# EAGLE design IDP5 (EAGLE 9.6.2)
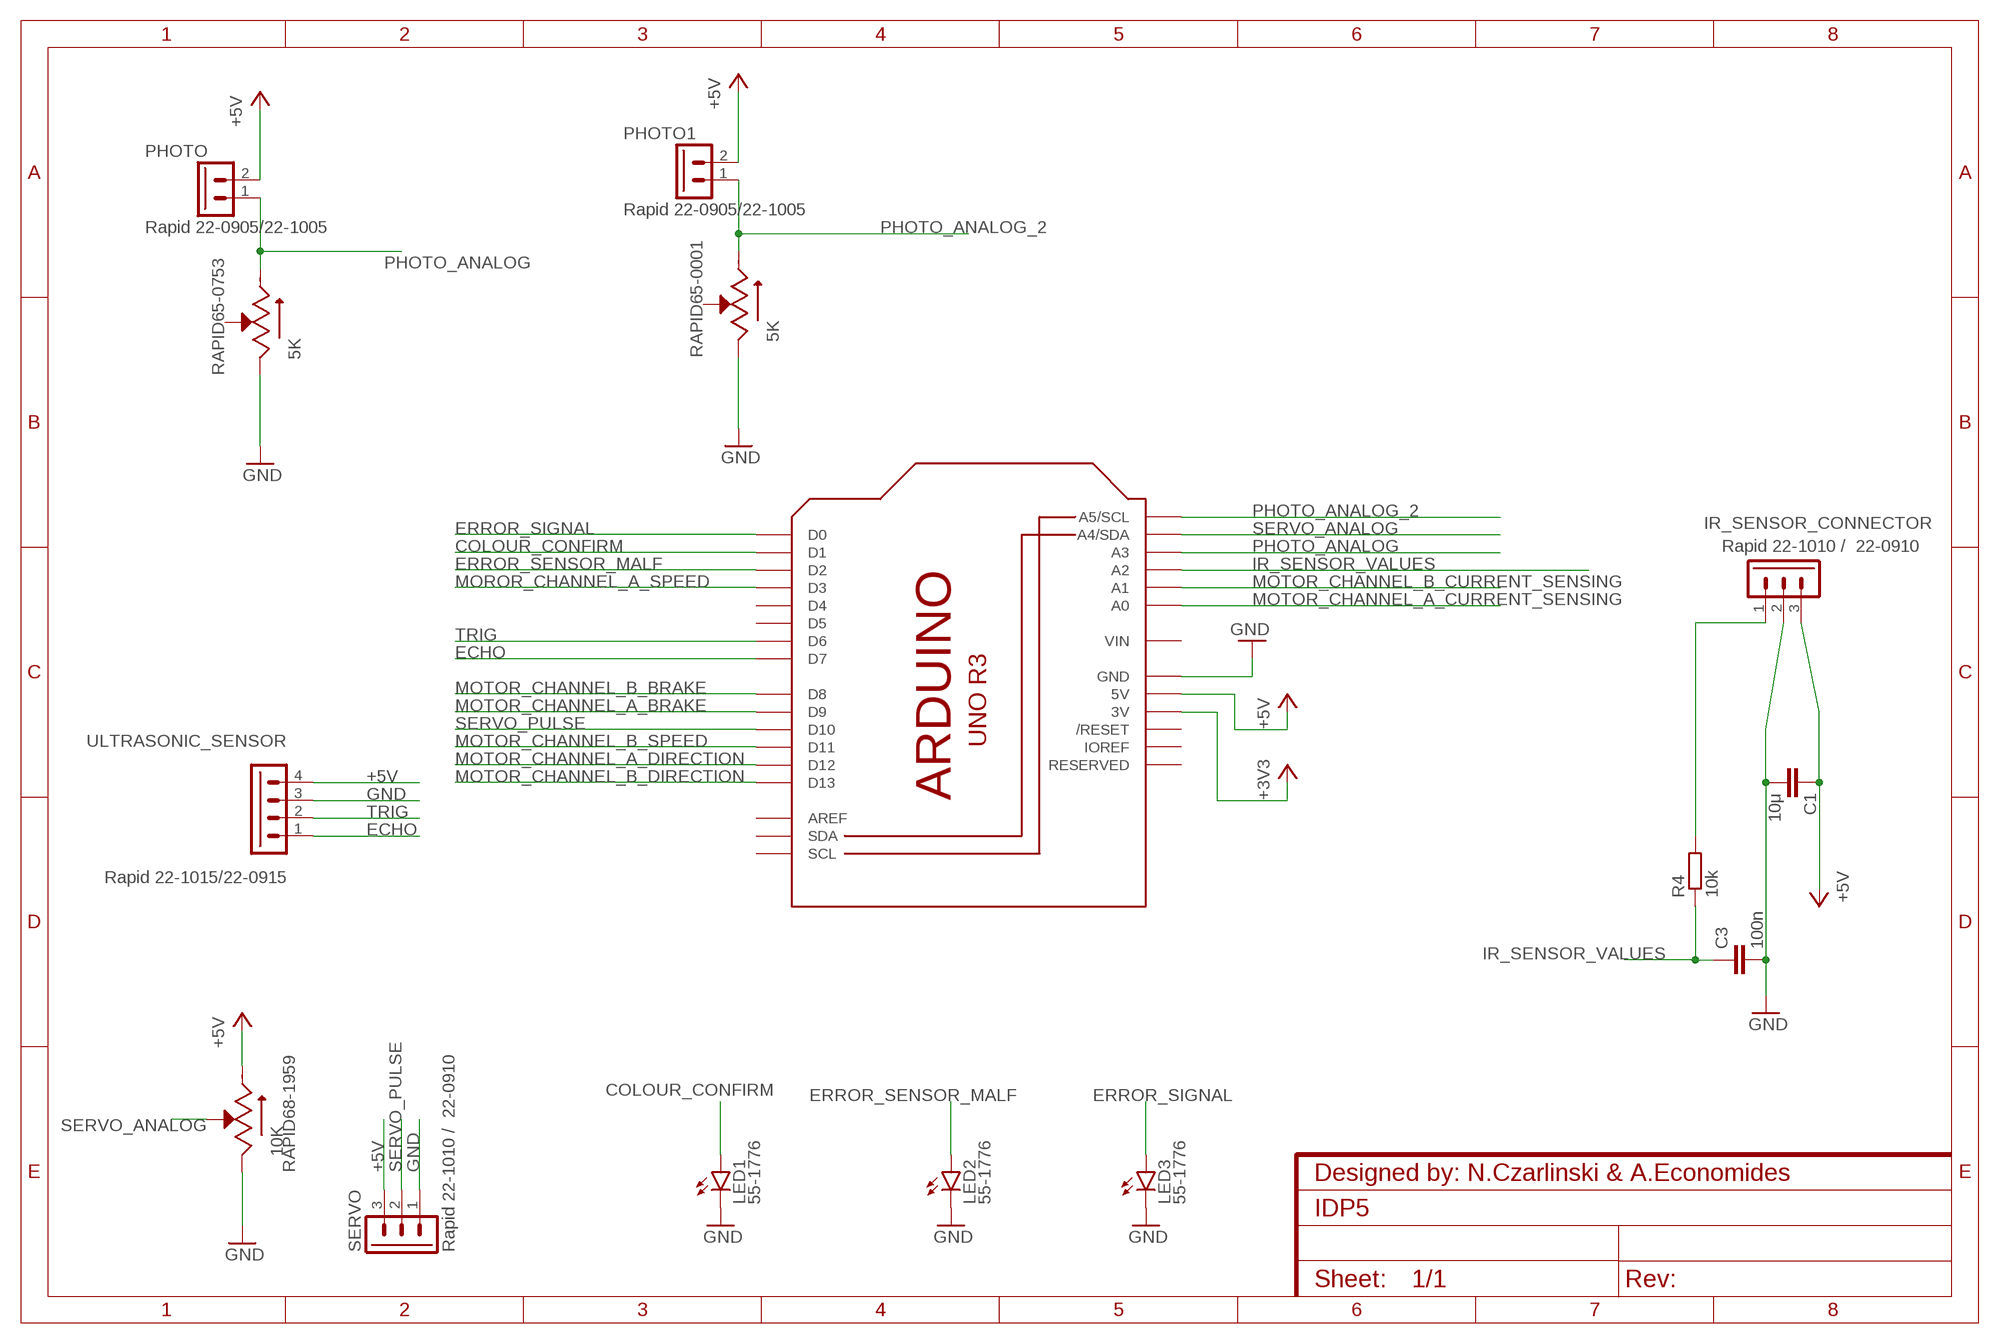
[diagram p0: schematic, sheet 1]
FRAME1 (FRAME-A4L): CNAME: Designed by: N.Czarlinski & A.Economides

## Parts
C1  10μ  C-EU025-024X044  [C025-024X044]
C3  100n  C-EU025-024X044  [C025-024X044]
IR_SENSOR_CONNECTOR  Rapid 22-1010 / 22-0910  22-05-7038-03  [7395-03]
LED1  55-1776  LED_23MM  [LED3MM]
LED2  55-1776  LED_23MM  [LED3MM]
LED3  55-1776  LED_23MM  [LED3MM]
M1  IDP_PROTOBOARD  [IDP_PROTO]
PHOTO  Rapid 22-0905/22-1005  22-05-7028-02  [7395-02]
PHOTO1  Rapid 22-0905/22-1005  22-05-7028-02  [7395-02]
R4  10k  R-EU_0204/7  [0204/7]
RAPID65-0001  5K  POT  [TRIM_3296W-1-250]
RAPID65-0753  5K  POT  [TRIM_3296W-1-250]
RAPID68-1959  10K  POT  [TRIM_3296W-1-250]
SERVO  Rapid 22-1010 / 22-0910  22-05-7038-03  [7395-03]
ULTRASONIC_SENSOR  Rapid 22-1015/22-0915  22-05-7048-04  [7395-04]

## Nets
+3V3: M1.3V
+5V: C1.1 IR_SENSOR_CONNECTOR.3 M1.5V M1.5V@0(5V) M1.5V@1(5V) M1.5V@2(5V) M1.5V@3(5V) M1.5V@4(5V) M1.5V@5(5V) M1.5V@6(5V) M1.5V@7(5V) M1.5V@8(5V) M1.5V@9(5V) M1.5V@10(5V) M1.5V@11(5V) M1.5V@12(5V) M1.5V@13(5V) M1.5V@14(5V) M1.5V@15(5V) M1.5V@16(5V) M1.5V@17(5V) M1.5V@18(5V) M1.5V@19(5V) M1.5V@20(5V) M1.5V@21(5V) M1.5V@22(5V) M1.5V@23(5V) M1.5V@24(5V) M1.5V@25(5V) M1.5V@26(5V) M1.5V@27(5V) M1.5V@28(5V) M1.5V@29(5V) M1.5V@30(5V) M1.5V@31(5V) M1.5V@32(5V) M1.5V@33(5V) M1.5V@34(5V) M1.5V@35(5V) M1.5V@36(5V) M1.5V@37(5V) M1.5V@38(5V) M1.5V@39(5V) M1.5V@40(5V) PHOTO1.2 PHOTO.2 RAPID68-1959.3(CW) SERVO.3 ULTRASONIC_SENSOR.4
COLOUR_CONFIRM: LED1.A M1.D1
ECHO: M1.D7 ULTRASONIC_SENSOR.1
ERROR_SENSOR_MALF: LED2.A M1.D2
ERROR_SIGNAL: LED3.A M1.D0
GND: C1.2 C3.2 IR_SENSOR_CONNECTOR.2 LED1.K(C) LED2.K(C) LED3.K(C) M1.GND M1.GND16(GND) M1.GND17(GND) M1.GND18(GND) M1.GND19(GND) M1.GND20(GND) M1.GND21(GND) M1.GND22(GND) M1.GND23(GND) M1.GND24(GND) M1.GND25(GND) M1.GND@1(GND) M1.GND@2(GND) M1.GND@3(GND) M1.GND@4(GND) M1.GND@5(GND) M1.GND@6(GND) M1.GND@7(GND) M1.GND@8(GND) M1.GND@9(GND) M1.GND@10(GND) M1.GND@11(GND) M1.GND@12(GND) M1.GND@13(GND) M1.GND@14(GND) M1.GND@15(GND) M1.GND@26(GND) M1.GND@27(GND) M1.GND@28(GND) M1.GND@29(GND) M1.GND@30(GND) M1.GND@31(GND) M1.GND@32(GND) M1.GND@33(GND) M1.GND@34(GND) M1.GND@35(GND) M1.GND@36(GND) M1.GND@37(GND) M1.GND@38(GND) M1.GND@39(GND) M1.GND@40(GND) M1.GND@41(GND) M1.GND@42(GND) M1.GND@43(GND) M1.GND@44(GND) M1.GND@45(GND) M1.GND@46(GND) M1.GND@47(GND) M1.GND@48(GND) RAPID65-0001.1(CCW) RAPID65-0753.1(CCW) RAPID68-1959.1(CCW) SERVO.1 ULTRASONIC_SENSOR.3
IR_SENSOR_VALUES: C3.1 M1.A2 R4.1
MOROR_CHANNEL_A_SPEED: M1.D3
MOTOR_CHANNEL_A_BRAKE: M1.D9
MOTOR_CHANNEL_A_CURRENT_SENSING: M1.A0
MOTOR_CHANNEL_A_DIRECTION: M1.D12
MOTOR_CHANNEL_B_BRAKE: M1.D8
MOTOR_CHANNEL_B_CURRENT_SENSING: M1.A1
MOTOR_CHANNEL_B_DIRECTION: M1.D13
MOTOR_CHANNEL_B_SPEED: M1.D11
N$5: IR_SENSOR_CONNECTOR.1 R4.2
PHOTO_ANALOG: M1.A3 PHOTO.1 RAPID65-0753.3(CW)
PHOTO_ANALOG_2: M1.A5(A5/SCL) PHOTO1.1 RAPID65-0001.3(CW)
SERVO_ANALOG: M1.A4(A4/SDA) RAPID68-1959.2(WIPER)
SERVO_PULSE: M1.D10 SERVO.2
TRIG: M1.D6 ULTRASONIC_SENSOR.2
Unconnected: M1.AREF M1.D4 M1.D5 M1.IOREF M1.RESERVED M1.RESET(/RESET) M1.SCL M1.SDA M1.VIN RAPID65-0001.2(WIPER) RAPID65-0753.2(WIPER)

## Library data of the parts
C1 C3 = IDP_library:C-EU: CAPACITOR, European symbol; SPICEPREFIX: C
IR_SENSOR_CONNECTOR SERVO = IDP_library:22-?-03: CONNECTOR wire to board 2.54 mm (.1 inch) pitch header 3 pin Right angle and straight; MF: MOLEX; OC_FARNELL: unknown; OC_NEWARK: unknown
LED1-LED3 = IDP_library:LED_2: LED
M1 = IDP_library:IDP_PROTOBOARD
PHOTO PHOTO1 = IDP_library:22-?-02: CONNECTOR wire to board 2.54 mm (.1 inch) pitch header 2 pin Right angle and straight; MF: MOLEX; OC_FARNELL: 9731601; OC_NEWARK: unknown
R4 = IDP_library:R-EU_: RESISTOR, European symbol; SPICEPREFIX: R
RAPID65-0001 RAPID65-0753 RAPID68-1959 = IDP_library:POT: Res Cermet Trimmer 500K Ohm 10% 0.5W 25(Elec)Turn 2.19mm (9.53 X 4.83 X 11.55mm) Pin Thru-Hole Tube; AVAILABILITY: Unavailable; DESCRIPTION: Trimpot 25 Ohm 3/8 Sq Cer Mt; MF: Bourns; MP: 3296W-1-250; PACKAGE: SOT-23-5 Bourns; PRICE: None
ULTRASONIC_SENSOR = IDP_library:22-?-04: CONNECTOR wire to board 2.54 mm (.1 inch) pitch header 4 pin Right angle and straight; MF: MOLEX; OC_FARNELL: unknown; OC_NEWARK: unknown

## Board
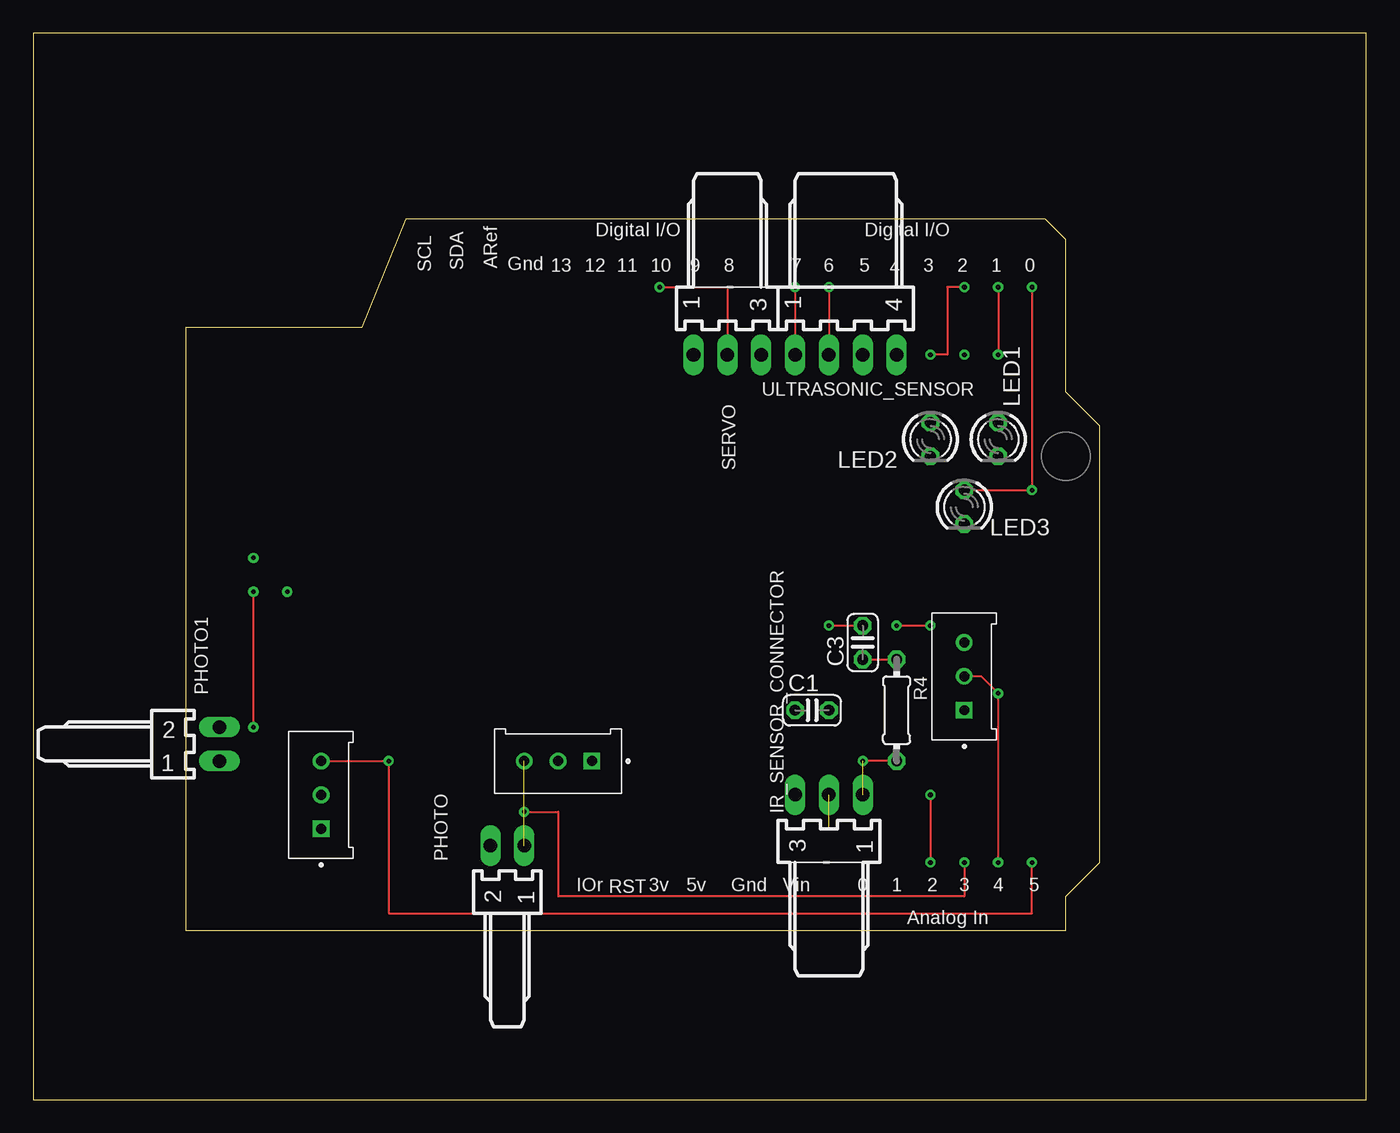
[diagram p1: board, top side]
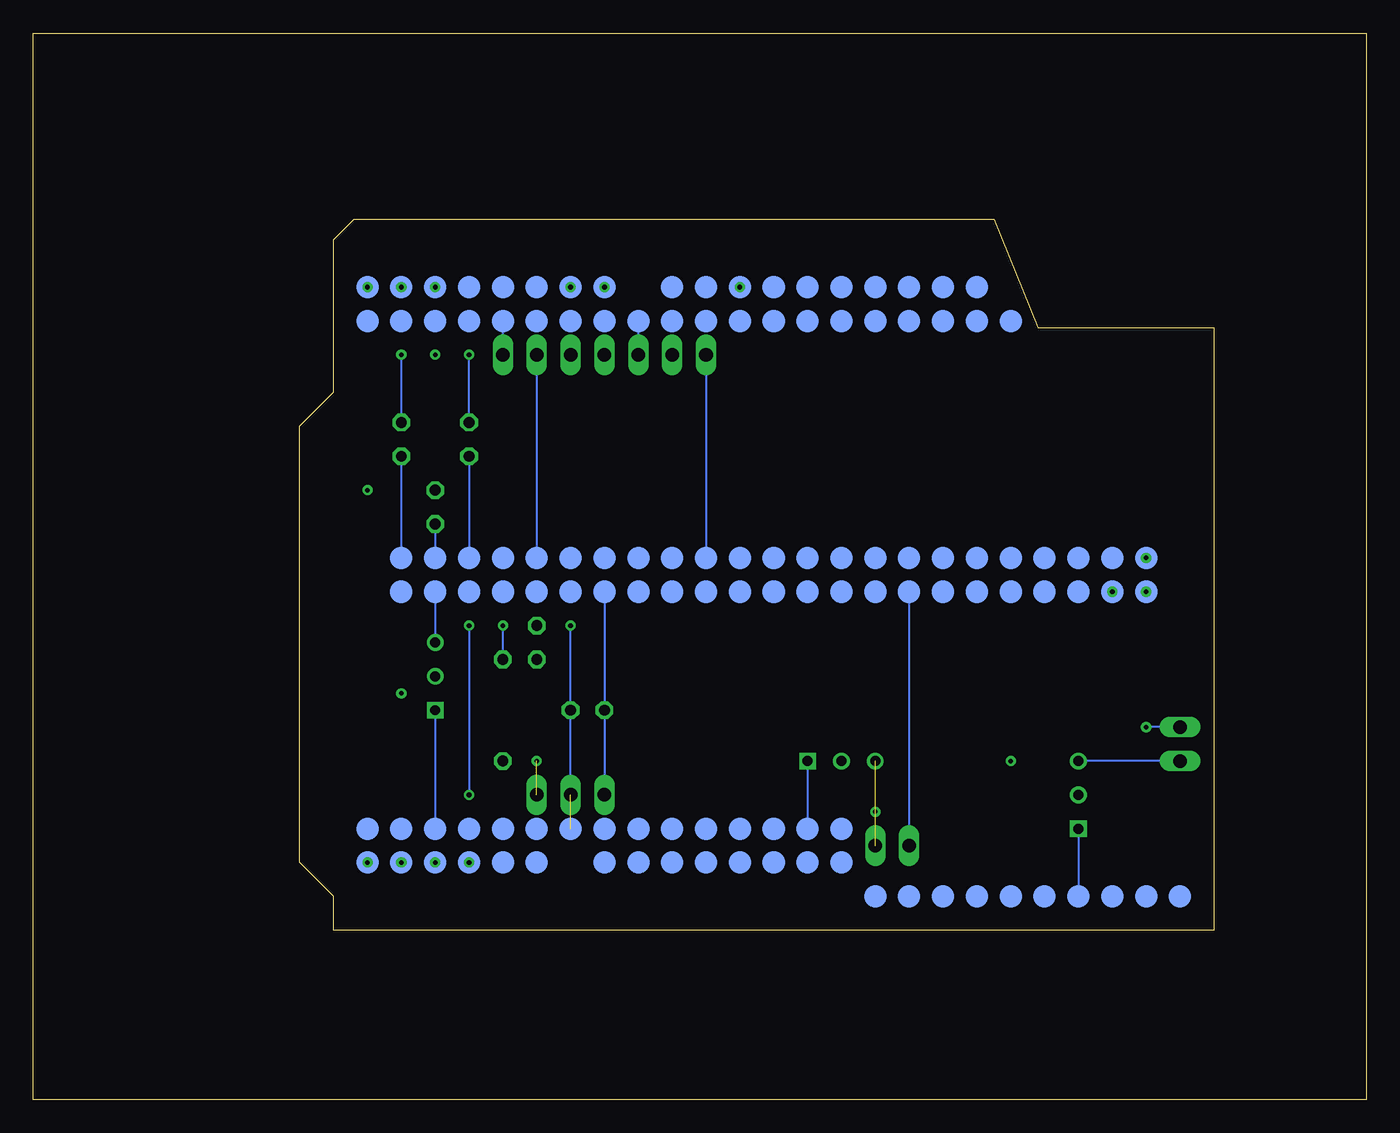
[diagram p2: board, bottom side, seen from below]

Size 100 x 80 mm. Coordinates in mm from the lower left corner, seen from the top.
Outline: 0,0 100,0 100,80 0,80 0,0
Copper layers (1*16): Top 0.035mm / dielectric 1.5mm / Bottom 0.035mm
Design rules "default": minimum track width 6mil, minimum drill 0.35mm, track to track 6mil, track to pad 6mil, pad to pad 6mil, via to via 6mil, smd to smd 6mil, copper to edge 40mil, drill to drill 6mil, minimum pad ring 10mil, minimum via ring 8mil, stop-mask expansion 4mil, vias tented up to drill 0mil, thermal gap 10mil

### Footprints (pad centres in the part's own frame; a part is rotated, then mirrored left to right if it is on the bottom)
C025-024X044 = drill 0.813 octagon: 1 0,0; 2 2.54,0
7395-03 = drill 1.016 long: 1 2.54,0; 2 0,0; 3 -2.54,0
LED3MM = drill 0.813 octagon: A -1.27,0; K 1.27,0
IDP_PROTO = smd 1.676 x 1.676 bottom: 3V 35.56,5.08; 5V 38.1,5.08; 5V@0 15.24,45.72; 5V@1 17.78,45.72; 5V@2 20.32,45.72; 5V@3 22.86,45.72; 5V@4 25.4,45.72; 5V@5 27.94,45.72; 5V@6 30.48,45.72; 5V@7 33.02,45.72; 5V@8 35.56,45.72; 5V@9 38.1,45.72; 5V@10 40.64,45.72; 5V@11 43.18,45.72; 5V@12 45.72,45.72; 5V@13 48.26,45.72; 5V@14 50.8,45.72; 5V@15 53.34,45.72; 5V@16 55.88,45.72; 5V@17 58.42,45.72; 5V@18 5.08,25.4; 5V@19 7.62,25.4; 5V@20 10.16,25.4; 5V@21 12.7,25.4; 5V@22 15.24,25.4; 5V@23 17.78,25.4; 5V@24 20.32,25.4; 5V@25 22.86,25.4; 5V@26 25.4,25.4; 5V@27 27.94,25.4; 5V@28 30.48,25.4; 5V@29 33.02,25.4; 5V@30 35.56,25.4; 5V@31 38.1,25.4; 5V@32 40.64,25.4; 5V@33 43.18,25.4; 5V@34 45.72,25.4; 5V@35 48.26,25.4; 5V@36 50.8,25.4; 5V@37 53.34,25.4; 5V@38 55.88,25.4; 5V@39 58.42,25.4; 5V@40 60.96,25.4; 5V@41 60.96,45.72; 5V@42 63.5,45.72; A0 50.8,5.08; A1 53.34,5.08; A2 55.88,5.08; A3 58.42,5.08; A4 60.96,5.08; A5 63.5,5.08; AREF 22.86,48.26; D0 63.5,48.26; D1 60.96,48.26; D2 58.42,48.26; D3 55.88,48.26; D4 53.34,48.26; D5 50.8,48.26; D6 48.26,48.26; D7 45.72,48.26; D8 40.64,48.26; D9 38.1,48.26; D10 35.56,48.26; D11 33.02,48.26; D12 30.48,48.26; D13 27.94,48.26; GND 25.4,48.26; GND16 2.54,2.54; GND17 5.08,2.54; GND18 7.62,2.54; GND19 10.16,2.54; GND20 12.7,2.54; GND21 15.24,2.54; GND22 17.78,2.54; GND23 20.32,2.54; GND24 22.86,2.54; GND25 25.4,2.54; GND@1 43.18,5.08; GND@2 40.64,5.08; GND@3 27.94,7.62; GND@4 30.48,7.62; GND@5 33.02,7.62; GND@6 35.56,7.62; GND@7 38.1,7.62; GND@8 40.64,7.62; GND@9 43.18,7.62; GND@10 45.72,7.62; GND@11 48.26,7.62; GND@12 50.8,7.62; GND@13 53.34,7.62; GND@14 55.88,7.62; GND@15 58.42,7.62; GND@16 60.96,7.62; GND@17 63.5,7.62; GND@26 5.08,27.94; GND@27 7.62,27.94; GND@28 10.16,27.94; GND@29 12.7,27.94; GND@30 15.24,27.94; GND@31 17.78,27.94; GND@32 20.32,27.94; GND@33 22.86,27.94; GND@34 25.4,27.94; GND@35 27.94,27.94; GND@36 30.48,27.94; GND@37 33.02,27.94; GND@38 35.56,27.94; GND@39 38.1,27.94; GND@40 40.64,27.94; GND@41 43.18,27.94; GND@42 45.72,27.94; GND@43 48.26,27.94; GND@44 50.8,27.94; GND@45 53.34,27.94; GND@46 55.88,27.94; GND@47 58.42,27.94; GND@48 60.96,27.94; IOREF 30.48,5.08; RESERVED 27.94,5.08; RESET 33.02,5.08; SCL 17.78,48.26; SDA 20.32,48.26; VIN 45.72,5.08
7395-02 = drill 1.016 long: 1 1.27,0; 2 -1.27,0
0204/7 = drill 0.813 octagon: 1 0,0; 2 7.62,0
TRIM_3296W-1-250 = drill 0.74 square: 1 -2.54,0 | drill 0.74: 2 0,0; 3 2.54,0
7395-04 = drill 1.016 long: 1 3.81,0; 2 1.27,0; 3 -1.27,0; 4 -3.81,0

### Placement (x,y rotation side)
C1  57.15,29.21 0 top
C3  62.23,33.02 90 top
IR_SENSOR_CONNECTOR  59.69,22.86 0 top
LED1  72.39,49.53 270 top
LED2  67.31,49.53 270 top
LED3  69.85,44.45 270 top
M1  11.43,12.7 0 top
PHOTO  35.56,19.05 0 top
PHOTO1  13.97,26.67 270 top
R4  64.77,33.02 270 top
RAPID65-0001  21.59,22.86 90 top
RAPID65-0753  39.37,25.4 180 top
RAPID68-1959  69.85,31.75 90 top
SERVO  52.07,55.88 180 top
ULTRASONIC_SENSOR  60.96,55.88 180 top

### Tracks (layer width: path | path; a pad name or v marks a point on that pad's centre or on a via)
+5V  (via drill 0.35)
  Top 0.152: M1.5V@18 v16.51,27.94
  Bottom 0.152: SERVO.3 M1.5V@11 | ULTRASONIC_SENSOR.4 M1.5V@15 | M1.5V@39 RAPID68-1959.3 | M1.5V@34 C1.1 IR_SENSOR_CONNECTOR.3 | M1.5V@25 PHOTO.2 | PHOTO1.2 v16.51,27.94
  other vias: 19.05,38.1 16.51,38.1
COLOUR_CONFIRM  (via drill 0.35)
  Top 0.152: M1.D1 v72.39,55.88
  Bottom 0.152: v72.39,55.88 LED1.A
  other vias: 72.39,60.96
ECHO  (via drill 0.35)
  Top 0.152: M1.D7 ULTRASONIC_SENSOR.1
  other vias: 57.15,60.96
ERROR_SENSOR_MALF  (via drill 0.35)
  Top 0.152: M1.D2 68.58,60.96 68.58,55.88 v67.31,55.88
  Bottom 0.152: LED2.A v67.31,55.88
  other vias: 69.85,60.96
ERROR_SIGNAL  (via drill 0.35)
  Top 0.152: M1.D0 v74.93,45.72 LED3.A
  other vias: 74.93,60.96
GND  (via drill 0.35)  (1 unrouted)
  Top 0.152: v59.69,35.56 C3.2
  Bottom 0.152: SERVO.1 M1.GND@39 | ULTRASONIC_SENSOR.3 M1.GND@44 | RAPID68-1959.1 M1.GND@15 | LED2.K M1.GND@46 | LED3.K M1.GND@47 | IR_SENSOR_CONNECTOR.2 C1.2 v59.69,35.56 | LED1.K M1.GND@48 | RAPID65-0001.1 M1.GND19 | RAPID65-0753.1 M1.GND@4
  other vias: 16.51,40.64
IR_SENSOR_VALUES  (via drill 0.35)
  Top 0.152: C3.1 R4.1 | v64.77,35.56 v67.31,35.56 | v67.31,22.86 M1.A2
  Bottom 0.152: R4.1 v64.77,35.56 | v67.31,35.56 v67.31,22.86
  other vias: 67.31,17.78
N$5  (via drill 0.35)  (1 unrouted)
  Top 0.152: R4.2 v62.23,25.4
N$6  (via drill 0.35)
  other vias: 69.85,55.88
PHOTO_ANALOG  (via drill 0.35)  (2 unrouted)
  Top 0.152: M1.A3 69.85,15.24 39.37,15.24 39.37,21.59 v36.83,21.59
  other vias: 69.85,17.78
PHOTO_ANALOG_2  (via drill 0.35)
  Top 0.152: RAPID65-0001.3 v26.67,25.4 26.67,13.97 74.93,13.97 M1.A5
  Bottom 0.152: PHOTO1.1 RAPID65-0001.3
  other vias: 74.93,17.78
SERVO_ANALOG  (via drill 0.35)
  Top 0.152: RAPID68-1959.2 71.12,31.75 v72.39,30.48 M1.A4
  other vias: 72.39,17.78
SERVO_PULSE  (via drill 0.35)
  Top 0.152: M1.D10 52.07,60.96 SERVO.2
  other vias: 46.99,60.96
TRIG  (via drill 0.35)
  Top 0.152: M1.D6 ULTRASONIC_SENSOR.2
  other vias: 59.69,60.96